# EAGLE design UBL_Distribution_V1p0 (EAGLE 9.6.2)
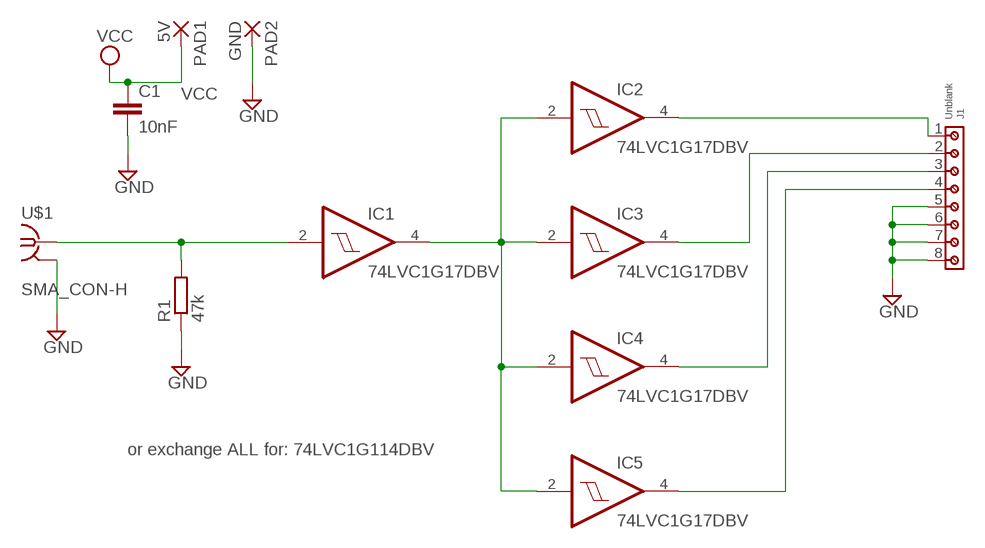
[diagram p0: schematic, sheet 1]

## Parts
C1  10nF  C-EUC0805  [C0805]
IC1  74LVC1G17DBV  [SOT23-5]
IC2  74LVC1G17DBV  [SOT23-5]
IC3  74LVC1G17DBV  [SOT23-5]
IC4  74LVC1G17DBV  [SOT23-5]
IC5  74LVC1G17DBV  [SOT23-5]
J1  Unblank  691210910008  [691210910008]
PAD1  5V  SMD5  [SMD2,54-5,08]
PAD2  GND  SMD5  [SMD2,54-5,08]
R1  47k  R-EU_R0805  [R0805]
U$1  SMA_CON-H  [BU-SMA-H]

## Nets
GND: C1.2 J1.5 J1.6 J1.7 J1.8 PAD2.1(P) R1.1 U$1.2(GND) U$1.3(GND) U$1.4(GND) U$1.5(GND)
N$1: IC1.2(I) R1.2 U$1.1
N$2: IC1.4(O) IC2.2(I) IC3.2(I) IC4.2(I) IC5.2(I)
N$3: IC2.4(O) J1.1
N$4: IC3.4(O) J1.2
N$5: IC4.4(O) J1.3
N$6: IC5.4(O) J1.4
VCC: C1.1 PAD1.1(P)

## Notes on the sheet
- or exchange ALL for: 74LVC1G114DBV

## Power pins joined to a net without a drawn wire
GND: IC1.3(GND) IC2.3(GND) IC3.3(GND) IC4.3(GND) IC5.3(GND)
VCC: IC1.5(VCC) IC2.5(VCC) IC3.5(VCC) IC4.5(VCC) IC5.5(VCC)

## Library data of the parts
C1 = rcl:C-EU: CAPACITOR, European symbol; SPICEPREFIX: C
IC1-IC5 = 74xx-little-us:74*1G17: Single Schmitt-Trigger Buffer
J1 = Wurth_Connectors_WR-TBL Rising Cage Clamp:691210910008: WR-TBL Serie 2109 - 2.54 mm Horiz. Entry KIND PROPERTIES Pitch 2.54 mm MATERIAL PROPERTIES Insulator Material PA66 Insulator Flammability Rating UL94 V-0 Insulator Color Green Contact Material Brass Contact Plating Copper over Zinc Terminal Screw Material Steel Terminal Screw Plating Zinc Wire Guard Material Brass GENERAL INFORMATION Operating Temperature -40 up to +105 °C Compliance Lead free / RoHS ELECTRICAL PROPERTIES IR cULus 6 A Working Voltage [cULus] 150 V (AC) Withstanding Voltage [cULus] 1300 V (AC) Contact Resistance [cULus] 20 mΩ MECHANICAL PROPERTIES Wire Strip Length 4 up to 5 (mm) Screw M1.6 Solid Wire Section (AWG) 30 to 18 (AWG) Solid Wire Section (Metric) 0.0509 to 0.823 (mm²) Stranded Wire Section (AWG) 30 to 18 (AWG) Stranded Wire Section (Metric) 0.0509 to 0.823 (mm²) CERTIFICATION cULus Approval E315414 PACKAGING PROPERTIES Packaging Box <https://katalog.we-online.com/media/images/v2/o33231v209%20Family_WR-TBL_69121091000x.jpg> Details see: https://katalog.we-online.com/en/em/TBL_2_54_2109_HORIZONTAL_ENTRY_69121091000X Updated by Ella Wu 2019-11-12 2019(C) Wurth Elektronik; DATASHEET-URL: https://www.we-online.com/catalog/datasheet/691210910008.pdf; IR-UL: 6A; MOUNT: THT; PART-NUMBER: 691210910008; PINS: 8; PITCH: 2.54mm; TYPE: Horizontal; WIRE: 30 to 18 (AWG) 0.0509 to 0.823 (mm²); WORKING-VOLTAGE-UL: 150V (AC)
PAD1 PAD2 = wirepad:SMD5: SMD PAD
R1 = rcl:R-EU_: RESISTOR, European symbol; SPICEPREFIX: R
U$1 = Orzada:SMA_CON

## Board
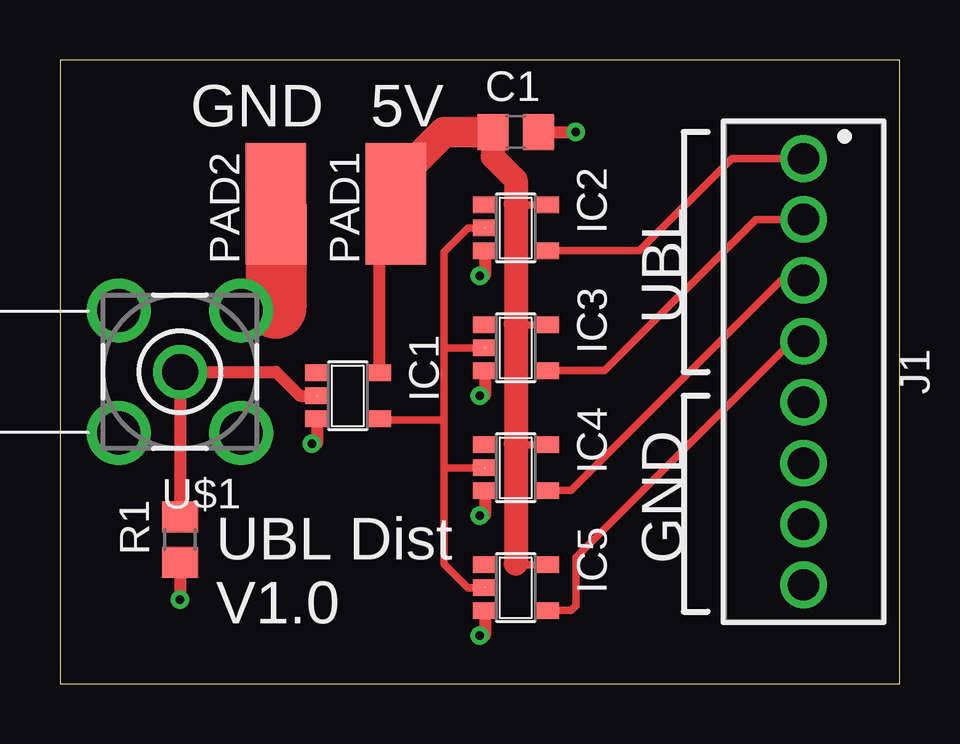
[diagram p1: board, top side]
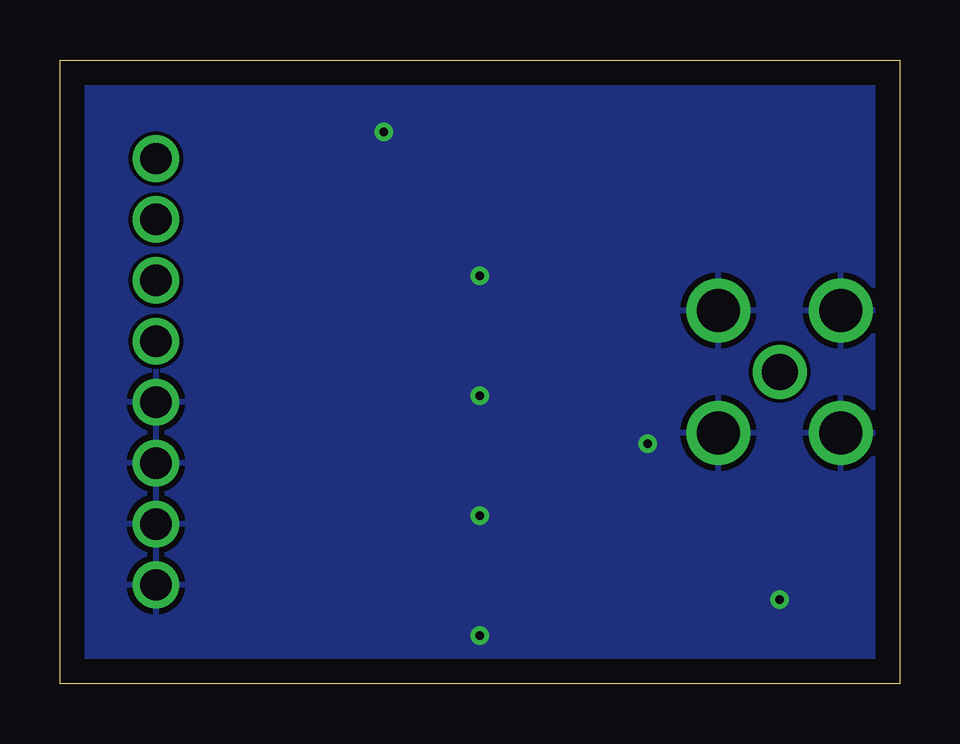
[diagram p2: board, bottom side, seen from below]

Size 35 x 26 mm. Coordinates in mm from the lower left corner, seen from the top.
Outline: 0,0 35,0 35,26 0,26 0,0
Copper layers (1*16): Top 0.035mm / dielectric 1.5mm / Bottom 0.035mm
Design rules "default": minimum track width 6mil, minimum drill 0.35mm, track to track 6mil, track to pad 6mil, pad to pad 6mil, via to via 6mil, smd to smd 6mil, copper to edge 40mil, drill to drill 6mil, minimum pad ring 10mil, minimum via ring 8mil, stop-mask expansion 4mil, vias tented up to drill 0mil, thermal gap 10mil

### Footprints (pad centres in the part's own frame; a part is rotated, then mirrored left to right if it is on the bottom)
C0805 = smd 1.3 x 1.5: 1 -0.95,0; 2 0.95,0
SOT23-5 = smd 0.69 x 0.99: 1 -0.95,-1.29; 2 0,-1.29; 3 0.95,-1.29; 4 0.95,1.3; 5 -0.95,1.3
691210910008 = drill 1.3: 1 -8.89,0; 2 -6.35,0; 3 -3.81,0; 4 -1.27,0; 5 1.27,0; 6 3.81,0; 7 6.35,0; 8 8.89,0
SMD2,54-5,08 = smd 2.54 x 5.08: 1 0,0
R0805 = smd 1.3 x 1.5: 1 -0.95,0; 2 0.95,0
BU-SMA-H = drill 1.5: 1 0,0 | drill 1.778: 2 -2.55,2.55; 3 2.55,2.55; 4 2.55,-2.55; 5 -2.55,-2.55

### Placement (x,y rotation side)
C1  19,23 0 top
IC1  12,12 270 top
IC2  19,19 270 top
IC3  19,14 270 top
IC4  19,9 270 top
IC5  19,4 270 top
J1  31,13 270 top
PAD1  14,20 0 top
PAD2  9,20 0 top
R1  5,6 90 top
U$1  5,13 180 top

### Tracks (layer width: path | path; a pad name or v marks a point on that pad's centre or on a via)
GND  (via drill 0.35)
  Top 0.508: R1.1 v5,3.5 | IC5.3 17.71,2 v17.5,2 | IC4.3 17.71,7 v17.5,7 | IC3.3 17.71,12 v17.5,12 | IC1.3 10.71,10 v10.5,10 | IC2.3 17.71,17 v17.5,17 | C1.2 v21.5,23
  Top 1: 9,15.65 9,15.55 U$1.5
  Top 2.54: PAD2.1 9,15.65
  pour Bottom: 1,25 1,1 34,1 34,25
N$1
  Top 0.508: IC1.2 10,12 9,13 U$1.1 R1.2
N$2
  Top 0.305: IC1.4 13.35,11 16,11 | IC5.2 17,4 16,5 16,9 | 16,11 16,9 | IC4.2 16,9 | 16,11 16,14 | 16,14 16,18 17,19 IC2.2 | IC3.2 16,14
N$3
  Top 0.305: IC2.4 24.16,18.05 28,21.89 J1.1
N$4
  Top 0.305: IC3.4 22.7,13.05 29,19.35 J1.2
N$5
  Top 0.305: J1.3 30.06,16.81 21.3,8.05 IC4.4
N$6
  Top 0.305: IC5.4 21.3,3.05 21.5,3.25 21.5,5.27 30.5,14.27 J1.4
VCC
  Top 0.305: IC5.5 19.05,4.95 19,5 | IC4.5 19.05,9.95 19,10 | IC3.5 19.05,14.95 19,15 | IC2.5 19.05,19.95 19,20 | PAD1.1 13.3,19.3
  Top 0.508: 13.3,19.3 IC1.5
  Top 1: C1.1 18.05,21.95 19,21 19,20 19,15 19,10 19,5
  Top 1.27: PAD1.1 14,21 16,23 C1.1

### Text on the board
tPlace: GND | 5V | UBL | GND | UBL Dist / V1.0